# Altium project TP1 - Codificador Morse - Grupo 9.PrjPcb
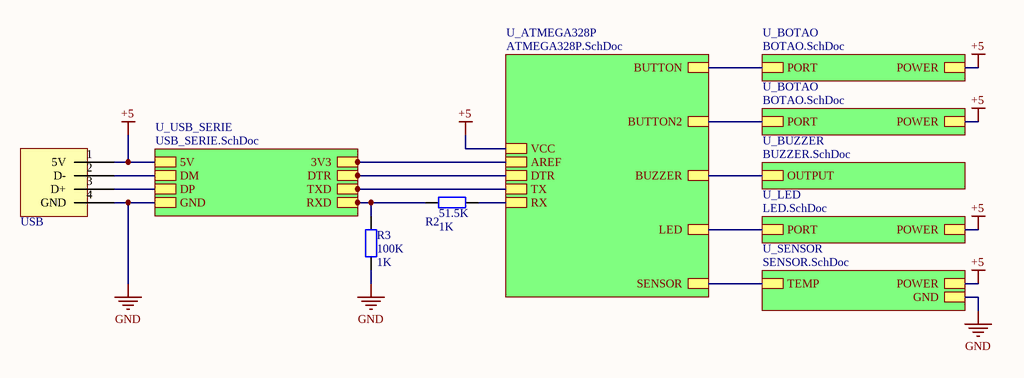
[diagram p0: MAIN.SchDoc]
7 sheets, 47 parts. Net scope: hierarchical (ports join the sheet entries above them; power ports are global).
Board file: MAIN.PcbDoc
Sheets:
  MAIN.SchDoc
    U_ATMEGA328P = ATMEGA328P.SchDoc
      U_BOTAO = BOTAO.SchDoc
    U_BOTAO = BOTAO.SchDoc
    U_BUZZER = BUZZER.SchDoc
    U_LED = LED.SchDoc
    U_SENSOR = SENSOR.SchDoc
    U_BOTAO = BOTAO.SchDoc
    U_USB_SERIE = USB_SERIE.SchDoc

## Sheet MAIN.SchDoc
size A4; SheetNumber: 1; SheetTotal: 7

### Parts
R2  51.5K  value 1K  [AXIAL-0.4]
R3  100K  value 1K  [AXIAL-0.4]
  USB  [USB_Port_PCB]

### Sub-sheets
U_ATMEGA328P = ATMEGA328P.SchDoc: DTR, SENSOR, BUTTON, BUTTON2, AREF, LED, BUZZER, RX, TX, VCC
U_BOTAO = BOTAO.SchDoc: POWER, PORT
U_BOTAO = BOTAO.SchDoc: POWER, PORT
U_BUZZER = BUZZER.SchDoc: OUTPUT
U_LED = LED.SchDoc: PORT, POWER
U_SENSOR = SENSOR.SchDoc: POWER, TEMP, GND
U_USB_SERIE = USB_SERIE.SchDoc: GND, DP, DM, 5V, TXD, DTR, RXD, 3V3

### Nets
+5: .1(5V) ; sheet U_ATMEGA328P/VCC, sheet U_BOTAO/POWER, sheet U_LED/POWER, sheet U_SENSOR/POWER, sheet U_BOTAO/POWER, sheet U_USB_SERIE/5V  [project net VCC]
GND: R3.1 .4(GND) ; sheet U_SENSOR/GND, sheet U_USB_SERIE/GND  [project net VBUS_DET]
VCCIO: sheet U_ATMEGA328P/AREF, sheet U_USB_SERIE/3V3
NetC4_1: sheet U_ATMEGA328P/DTR, sheet U_USB_SERIE/DTR
NetC5_U_BOTAO2_2: sheet U_ATMEGA328P/BUTTON2, sheet U_BOTAO/PORT
NetC5_U_BOTAO3_2: sheet U_ATMEGA328P/BUTTON, sheet U_BOTAO/PORT
NetC7_1: sheet U_ATMEGA328P/SENSOR, sheet U_SENSOR/TEMP
NetC10_2: .2(D-) ; sheet U_USB_SERIE/DM
NetC11_2: .3(D+) ; sheet U_USB_SERIE/DP
NetD1_C: sheet U_ATMEGA328P/LED, sheet U_LED/PORT
NetR2_1: R2.1 R3.2 ; sheet U_USB_SERIE/RXD
NetR2_2: R2.2 ; sheet U_ATMEGA328P/RX
NetR5_2: sheet U_ATMEGA328P/BUZZER, sheet U_BUZZER/OUTPUT
NetU1_3: sheet U_ATMEGA328P/TX, sheet U_USB_SERIE/TXD

### Library data of the parts
R2 R3 = Res2: Resistor; Published: 8-Jun-2000; LatestRevisionDate: 17-Jul-2002; LatestRevisionNote: Re-released for DXP Platform.; PackageReference: AXIAL-0.4; Publisher: Altium Limited; PackageDescription: Axial Device, Thru-Hole; 2 Leads; 0.4 in Pin Spacing

## Sheet ATMEGA328P.SchDoc
size A4; SheetNumber: 2; SheetTotal: 7; SPICEModelCacheTSLKCINH: <root> / <DocumentId>TSLKCINH</DocumentId> / <CacheFrame Number="0"> / <Model Name="cap" Kind="MDL"> / <Text>*Default semiconductor capacitor / .MODEL CAP C()</Text> / </Model> / </CacheFrame> / </root>
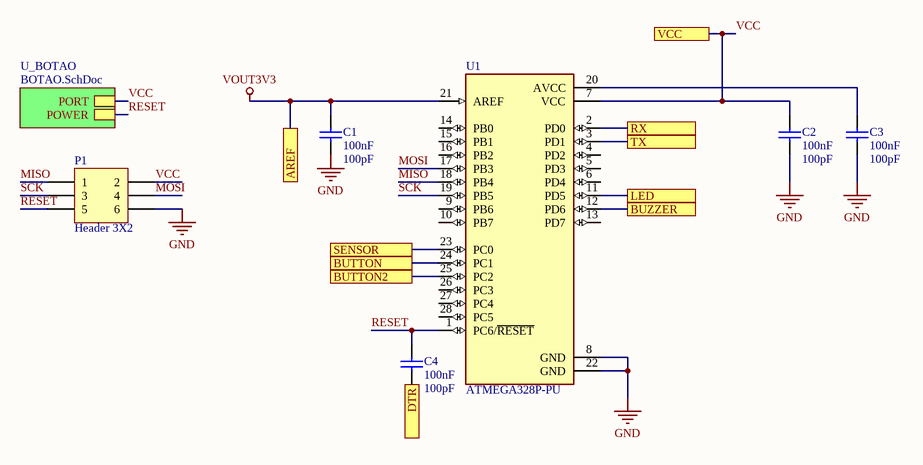
[diagram p1: ATMEGA328P.SchDoc]

### Parts
C1  100nF  value 100pF  [RAD-0.3]
C2  100nF  value 100pF  [RAD-0.3]
C3  100nF  value 100pF  [RAD-0.3]
C4  100nF  value 100pF  [RAD-0.3]
P1  Header 3X2  [HDR2X3]
U1  ATMEGA328P-PU  [DIP794W46P254L2967H457Q28B]

### Sub-sheets
U_BOTAO = BOTAO.SchDoc: POWER, PORT

### Ports
AREF, BUTTON, BUTTON2, BUZZER, DTR, LED, RX, SENSOR, TX, VCC

### Nets
GND: C1.1 C2.1 C3.1 P1.6 U1.8(GND) U1.22(GND)  [project net VBUS_DET]
VCC: C2.2 P1.2 U1.7(VCC) ; port VCC, sheet U_BOTAO/PORT
VOUT3V3: C1.2 U1.21(AREF) ; port AREF  [project net VCCIO]
MISO: P1.1 U1.18(PB4)
MOSI: P1.4 U1.17(PB3)
RESET: C4.2 P1.5 U1.1(PC6/~{RESET}) ; sheet U_BOTAO/POWER
SCK: P1.3 U1.19(PB5)
NetC3_2: C3.2 U1.20(AVCC)
NetC4_1: C4.1 ; port DTR
NetC5_U_BOTAO2_2: U1.25(PC2) ; port BUTTON2
NetC5_U_BOTAO3_2: U1.24(PC1) ; port BUTTON
NetC7_1: U1.23(PC0) ; port SENSOR
NetD1_C: U1.11(PD5) ; port LED
NetR2_2: U1.2(PD0) ; port RX
NetR5_2: U1.12(PD6) ; port BUZZER
NetU1_3: U1.3(PD1) ; port TX

Not connected (* = marked no-connect by the designer): U1 4(PD2) 5(PD3) 6(PD4) 9(PB6) 10(PB7) 13(PD7) 14(PB0) 15(PB1) 16(PB2) 26(PC3) 27(PC4) 28(PC5)

### Library data of the parts
C1-C4 = Cap: Capacitor; Published: 8-Jun-2000; LatestRevisionDate: 17-Jul-2002; LatestRevisionNote: Re-released for DXP Platform.; PackageReference: RAD-0.3; Publisher: Altium Limited; PackageDescription: Radial Cap, Thru-Hole; 2 Leads; 0.3 in Pin Spacing
P1 = Header 3X2: Header, 3-Pin, Dual row; LatestRevisionDate: 17-Jul-2002; LatestRevisionNote: Re-released for DXP Platform.; Publisher: Altium Limited
U1 = ATMEGA328P-PU: ATmega Series 20 MHz 32 KB Flash 2 KB SRAM 8-Bit Microcontroller - DIP-28; MP: ATMEGA328P-PU; Package: None; Availability: Unavailable; Price: None; Value: *

## Sheet BOTAO.SchDoc
size A4; SheetNumber: 4; SheetTotal: 7; SPICEModelCacheDMJNRZEX: <root> / <DocumentId>DMJNRZEX</DocumentId> / <CacheFrame Number="0"> / <Model Name="cap" Kind="MDL"> / <Text>*Default semiconductor capacitor / .MODEL CAP C()</Text> / </Model> / </CacheFrame> / </root>
Used 3 times, as channels U_ATMEGA328P/U_BOTAO, U_BOTAO, U_BOTAO. Parts and nets are listed once, with the designators drawn on the sheet.
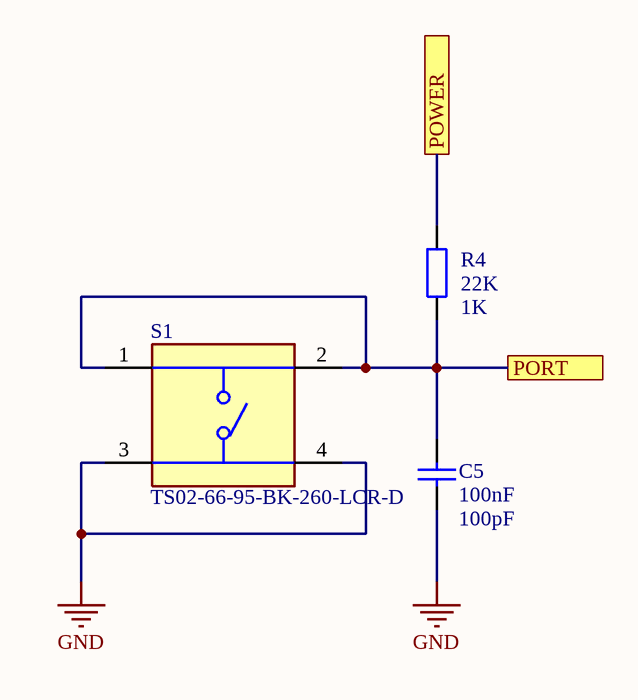
[diagram p2: BOTAO.SchDoc]

### Parts
C5  100nF  value 100pF  [RAD-0.3]
R4  22K  value 1K  [AXIAL-0.4]
S1  TS02-66-95-BK-260-LCR-D  [SW_TS02-66-95-BK-260-LCR-D]

### Ports
PORT, POWER

### Nets
GND: C5.1 S1.3 S1.4
PORT: C5.2 R4.1 S1.1 S1.2 ; port PORT
POWER: R4.2 ; port POWER

### Channels
U_ATMEGA328P/U_BOTAO: designators end in _U_BOTAO1; ports PORT=VCC POWER=RESET
U_BOTAO: designators end in _U_BOTAO3; ports PORT=NetC5_U_BOTAO3_2 POWER=VCC
U_BOTAO: designators end in _U_BOTAO2; ports PORT=NetC5_U_BOTAO2_2 POWER=VCC

### Library data of the parts
C5 = Cap: Capacitor; Published: 8-Jun-2000; LatestRevisionDate: 17-Jul-2002; LatestRevisionNote: Re-released for DXP Platform.; PackageReference: RAD-0.3; Publisher: Altium Limited; PackageDescription: Radial Cap, Thru-Hole; 2 Leads; 0.3 in Pin Spacing
R4 = Res2: Resistor; Published: 8-Jun-2000; LatestRevisionDate: 17-Jul-2002; LatestRevisionNote: Re-released for DXP Platform.; PackageReference: AXIAL-0.4; Publisher: Altium Limited; PackageDescription: Axial Device, Thru-Hole; 2 Leads; 0.4 in Pin Spacing
S1 = TS02-66-95-BK-260-LCR-D: Price: None; Availability: Unavailable; MP: TS02-66-95-BK-260-LCR-D; Value: *; Package: None

## Sheet BUZZER.SchDoc
size A4; SheetNumber: 5; SheetTotal: 7
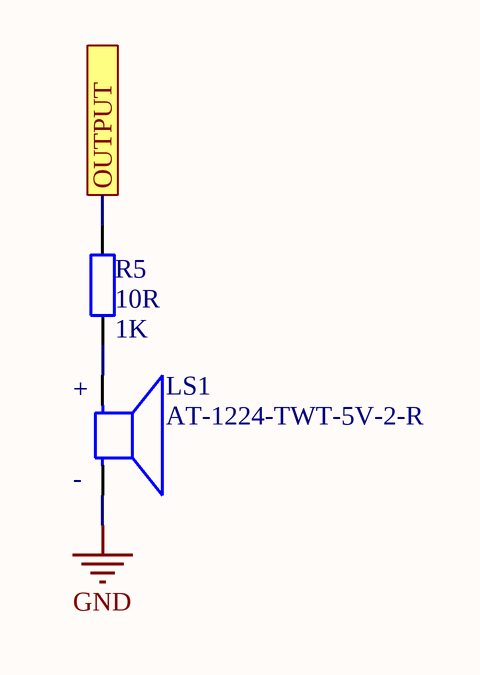
[diagram p3: BUZZER.SchDoc]

### Parts
LS1  AT-1224-TWT-5V-2-R  [XDCR_AT-1224-TWT-5V-2-R]
R5  10R  value 1K  [AXIAL-0.4]

### Ports
OUTPUT

### Nets
GND: LS1.N  [project net VBUS_DET]
NetLS1_P: LS1.P R5.1
NetR5_2: R5.2 ; port OUTPUT

### Notes on the sheet
- (in symbol AT-1224-TWT-5V-2-R) +; -

### Library data of the parts
LS1 = AT-1224-TWT-5V-2-R: AUDIO TRANSDUCER 12 VP-P 85 DB 2400 HZ; Package: None; Price: None; Value: *; MP: AT-1224-TWT-5V-2-R; Availability: Unavailable
R5 = Res2: Resistor; Published: 8-Jun-2000; LatestRevisionDate: 17-Jul-2002; LatestRevisionNote: Re-released for DXP Platform.; PackageReference: AXIAL-0.4; Publisher: Altium Limited; PackageDescription: Axial Device, Thru-Hole; 2 Leads; 0.4 in Pin Spacing

## Sheet LED.SchDoc
size A4; SheetNumber: 3; SheetTotal: 7
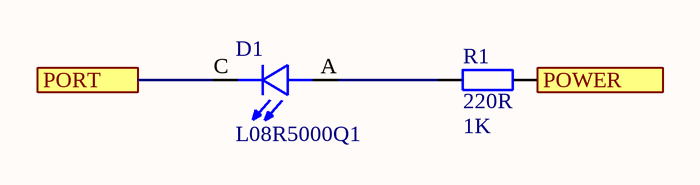
[diagram p4: LED.SchDoc]

### Parts
D1  L08R5000Q1  [LEDRD254W57D500H1070]
R1  220R  value 1K  [AXIAL-0.4]

### Ports
PORT, POWER

### Nets
VCC: R1.2 ; port POWER
NetD1_A: D1.A R1.1
NetD1_C: D1.C ; port PORT

### Library data of the parts
D1 = L08R5000Q1: LED, 5MM, ORANGE; LED / Lamp Size: 5mm / T-1 3/4; LED Colour: Orange; Typ Luminous Intensity: 4.3mcd; Viewing Angle: ...; MF: LED Technology; Value: *; SnapEDA_Link: https://www.snapeda.com/parts/L08R5000Q1/LED+Technology/view-part/?ref=snap; MP: L08R5000Q1; Check_prices: https://www.snapeda.com/parts/L08R5000Q1/LED+Technology/view-part/?ref=eda; Availability: In Stock; Price: None; Package: None
R1 = Res2: Resistor; Published: 8-Jun-2000; LatestRevisionDate: 17-Jul-2002; LatestRevisionNote: Re-released for DXP Platform.; PackageReference: AXIAL-0.4; Publisher: Altium Limited; PackageDescription: Axial Device, Thru-Hole; 2 Leads; 0.4 in Pin Spacing

## Sheet SENSOR.SchDoc
size A4; SheetNumber: 6; SheetTotal: 7; SPICEModelCacheEPDGRBMA: <root> / <DocumentId>EPDGRBMA</DocumentId> / <CacheFrame Number="0"> / <Model Name="cap" Kind="MDL"> / <Text>*Default semiconductor capacitor / .MODEL CAP C()</Text> / </Model> / </CacheFrame> / </root>
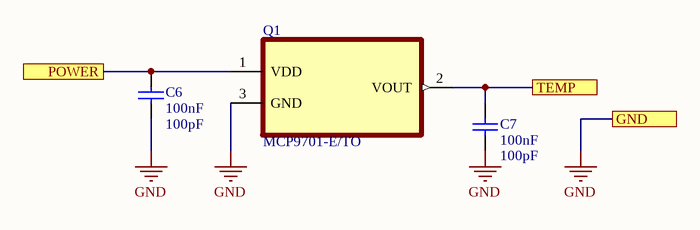
[diagram p5: SENSOR.SchDoc]

### Parts
C6  100nF  value 100pF  [RAD-0.3]
C7  100nF  value 100pF  [RAD-0.3]
Q1  MCP9701-E/TO  [TO127P254X533-3]

### Ports
GND, POWER, TEMP

### Nets
GND: C6.2 C7.2 Q1.3(GND) ; port GND  [project net VBUS_DET]
VCC: C6.1 Q1.1(VDD) ; port POWER
NetC7_1: C7.1 Q1.2(VOUT) ; port TEMP

### Library data of the parts
C6 C7 = Cap: Capacitor; Published: 8-Jun-2000; LatestRevisionDate: 17-Jul-2002; LatestRevisionNote: Re-released for DXP Platform.; PackageReference: RAD-0.3; Publisher: Altium Limited; PackageDescription: Radial Cap, Thru-Hole; 2 Leads; 0.3 in Pin Spacing
Q1 = MCP9701-E/TO: 3 TO-92 4x4mm BAG, Linear Active Thermister (TM) IC (19.53mV/oC) | Microchip Technology Inc. MCP9701-E/TO; SnapEDA_Link: https://www.snapeda.com/parts/MCP9701-E/TO/Microchip/view-part/?ref=snap; Package: TO-92 Microchip; Value: *; MF: Microchip Technology; MP: MCP9701-E/TO; Check_prices: https://www.snapeda.com/parts/MCP9701-E/TO/Microchip/view-part/?ref=eda

## Sheet USB_SERIE.SchDoc
size A4; SheetNumber: 7; SheetTotal: 7; SPICEModelCacheZQRZJMEL: <root> / <DocumentId>ZQRZJMEL</DocumentId> / </root>
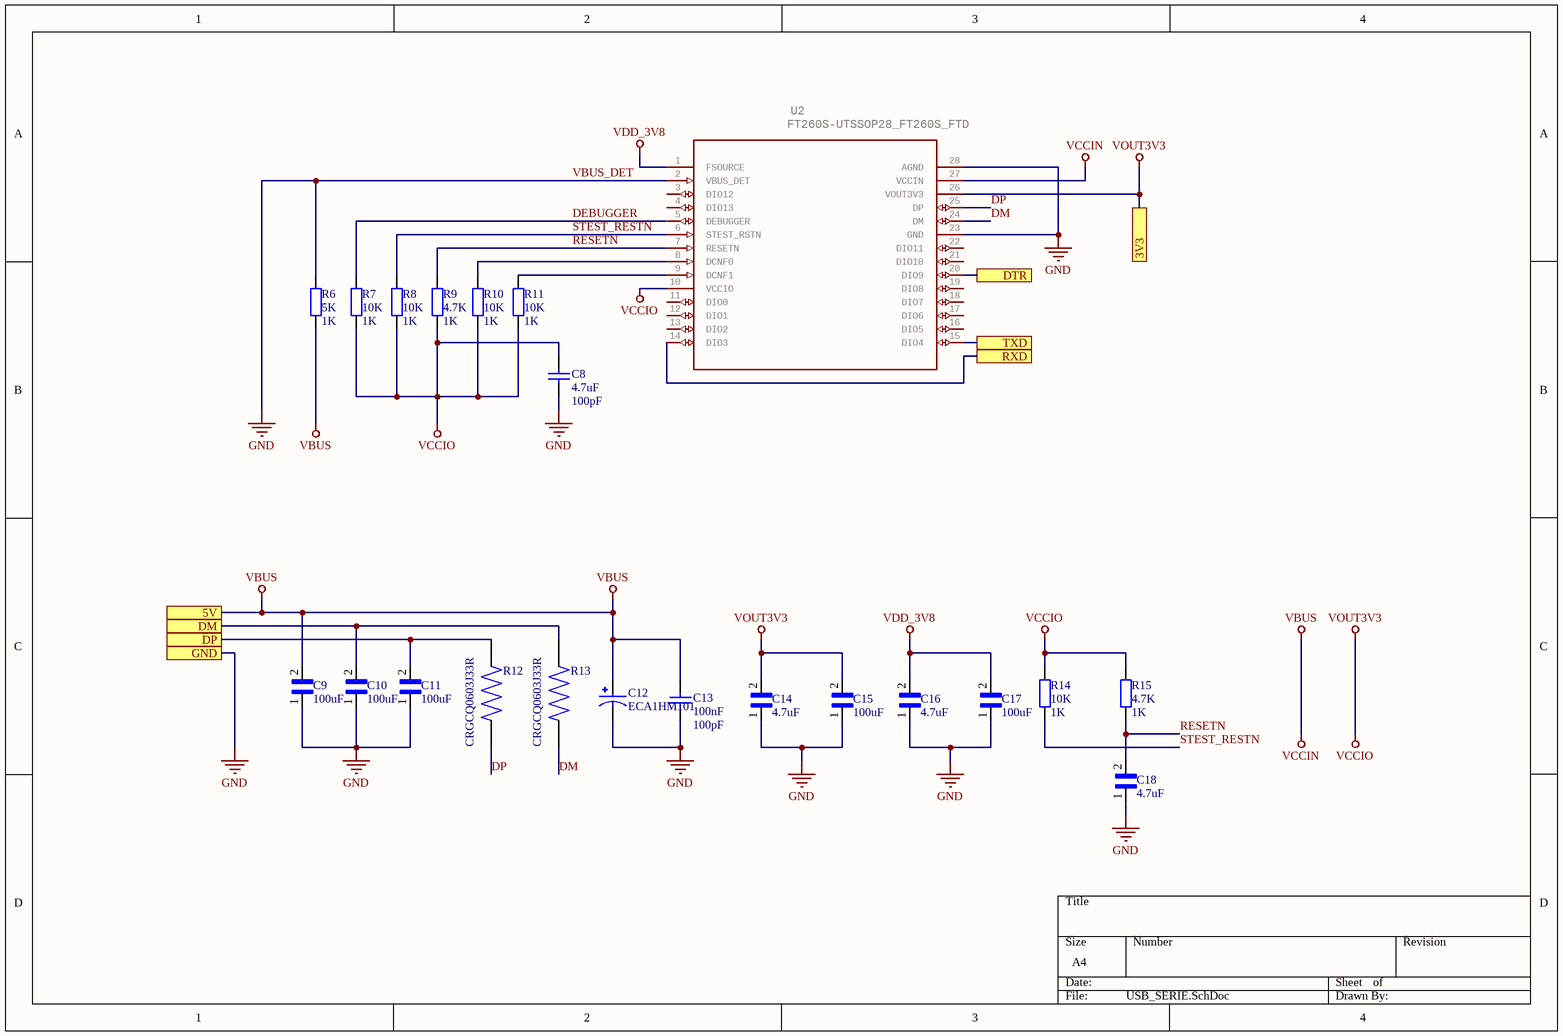
[diagram p6: USB_SERIE.SchDoc]

### Parts
C8  4.7uF  value 100pF  [RAD-0.3]
C9  100uF  [CAPC1608X90N]
C10  100uF  [CAPC1608X90N]
C11  100uF  [CAPC1608X90N]
C12  ECA1HM101  [CAPPRD350W60D800H1150]
C13  100nF  value 100pF  [RAD-0.3]
C14  4.7uF  [CAPC1608X94N]
C15  100uF  [CAPC1608X90N]
C16  4.7uF  [CAPC1608X94N]
C17  100uF  [CAPC1608X90N]
C18  4.7uF  [CAPC1608X94N]
R6  5K  value 1K  [AXIAL-0.4]
R7  10K  value 1K  [AXIAL-0.4]
R8  10K  value 1K  [AXIAL-0.4]
R9  4.7K  value 1K  [AXIAL-0.4]
R10  10K  value 1K  [AXIAL-0.4]
R11  10K  value 1K  [AXIAL-0.4]
R12  CRGCQ0603J33R  [RESC1608X55N]
R13  CRGCQ0603J33R  [RESC1608X55N]
R14  10K  value 1K  [AXIAL-0.4]
R15  4.7K  value 1K  [AXIAL-0.4]
U2  FT260S-UTSSOP28_FT260S_FTD  [SOP65P640X110-28N]

### Ports
3V3, 5V, DM, DP, DTR, GND, RXD, TXD

### Nets
VBUS: C9.2 C12.P C13.2 R6.1 U2.27(VCCIN) ; port 5V  [also labelled VCCIN]  [project net VCC]
VBUS_DET: C8.1 C9.1 C10.1 C11.1 C12.N C13.1 C14.1 C15.1 C16.1 C17.1 C18.1 R6.2 U2.2(VBUS_DET) U2.23(GND) U2.28(AGND) ; port GND  [also labelled GND]
VCCIO: C8.2 C14.2 C15.2 R7.1 R8.1 R9.1 R10.1 R11.1 R14.2 R15.2 U2.10(VCCIO) U2.26(VOUT3V3) ; port 3V3  [also labelled VOUT3V3]
VDD_3V8: C16.2 C17.2 U2.1(FSOURCE)
DEBUGGER: R7.2 U2.5(DEBUGGER)
DM: R13.1 U2.24(DM)
DP: R12.1 U2.25(DP)
RESETN: C18.2 R9.2 R15.1 U2.7(RESETN)
STEST_RESTN: R8.2 R14.1 U2.6(STEST_RSTN)
NetC4_1: U2.20(DIO9) ; port DTR
NetC10_2: C10.2 R13.2 ; port DM
NetC11_2: C11.2 R12.2 ; port DP
NetR2_1: U2.14(DIO3) ; port RXD
NetR10_2: R10.2 U2.8(DCNF0)
NetR11_2: R11.2 U2.9(DCNF1)
NetU1_3: U2.15(DIO4) ; port TXD

Not connected (* = marked no-connect by the designer): U2 3(DIO12) 4(DIO13) 11(DIO0) 12(DIO1) 13(DIO2) 16(DIO5) 17(DIO6) 18(DIO7) 19(DIO8) 21(DIO10) 22(DIO11)

### Library data of the parts
C8 C13 = Cap: Capacitor; Published: 8-Jun-2000; LatestRevisionDate: 17-Jul-2002; LatestRevisionNote: Re-released for DXP Platform.; PackageReference: RAD-0.3; Publisher: Altium Limited; PackageDescription: Radial Cap, Thru-Hole; 2 Leads; 0.3 in Pin Spacing
C9-C11 C15 C17 = 06033C103KAT2A: Cap Ceramic 0.01uF 25V X7R 10% Pad SMD 0603 125C T/R; Package: None; Price: None; Value: *; MP: 06033C103KAT2A; Availability: Unavailable
C12 = ECA1HM101: 100ÂµF 50V Aluminum Electrolytic Capacitors Radial, Can 2000 Hrs @ 85Â°C; MF: Panasonic; Check_prices: https://www.snapeda.com/parts/ECA1HM101/Panasonic/view-part/4478734/?ref=eda; SnapEDA_Link: https://www.snapeda.com/parts/ECA1HM101/Panasonic/view-part/4478734/?ref=snap; Price: None; Availability: No availability data; Package: RADIAL-2 Panasonic; MP: ECA1HM101; Value: *
C14 C16 C18 = 06036D475KAT4A: Cap Ceramic 4.7uF 6.3V X5R 10% SMD 0603 85Â°C Paper T/R; Package: None; Price: None; Value: *; MP: 06036D475KAT4A; Availability: Unavailable
R6-R11 R14 R15 = Res2: Resistor; Published: 8-Jun-2000; LatestRevisionDate: 17-Jul-2002; LatestRevisionNote: Re-released for DXP Platform.; PackageReference: AXIAL-0.4; Publisher: Altium Limited; PackageDescription: Axial Device, Thru-Hole; 2 Leads; 0.4 in Pin Spacing
R12 R13 = CRGCQ0603J33R: Fixed Resistor CRGCQ 0603 33R 5%; Package: None; Price: None; Value: *; MP: CRGCQ0603J33R; Availability: Unavailable
U2 = FT260S-UTSSOP28_FT260S_FTD: Mfr_Name: FTDI, Future Technology Devices International Ltd; GateName_1: A; SymbolName_1: FT260S-U; DeviceName: TSSOP28_FT260S_FTD; LibraryName: 2024-10-31_11-49-55_Library; DeviceSetName: FT260S-U; Package: TSSOP28_FT260S_FTD; Copyright: Copyright (C) 2024 Ultra Librarian. All rights reserved.; Manufacturer_Part_Number: FT260S-U

## Nets that join several sheets
VBUS_DET: MAIN (R3.1 .4), ATMEGA328P (6 pins), U_ATMEGA328P/U_BOTAO (C5_U_BOTAO1.1 S1_U_BOTAO1.3 S1_U_BOTAO1.4), U_BOTAO (C5_U_BOTAO3.1 S1_U_BOTAO3.3 S1_U_BOTAO3.4), BUZZER (LS1.N), SENSOR (C6.2 C7.2 Q1.3), U_BOTAO (C5_U_BOTAO2.1 S1_U_BOTAO2.3 S1_U_BOTAO2.4), USB_SERIE (15 pins)
VCC: MAIN (.1), ATMEGA328P (C2.2 P1.2 U1.7), U_ATMEGA328P/U_BOTAO (C5_U_BOTAO1.2 R4_U_BOTAO1.1 S1_U_BOTAO1.1 S1_U_BOTAO1.2), U_BOTAO (R4_U_BOTAO3.2), LED (R1.2), SENSOR (C6.1 Q1.1), U_BOTAO (R4_U_BOTAO2.2), USB_SERIE (5 pins)
VCCIO: ATMEGA328P (C1.2 U1.21), USB_SERIE (12 pins)
NetC4_1: ATMEGA328P (C4.1), USB_SERIE (U2.20)
NetC5_U_BOTAO2_2: ATMEGA328P (U1.25), U_BOTAO (C5_U_BOTAO2.2 R4_U_BOTAO2.1 S1_U_BOTAO2.1 S1_U_BOTAO2.2)
NetC5_U_BOTAO3_2: ATMEGA328P (U1.24), U_BOTAO (C5_U_BOTAO3.2 R4_U_BOTAO3.1 S1_U_BOTAO3.1 S1_U_BOTAO3.2)
NetC7_1: ATMEGA328P (U1.23), SENSOR (C7.1 Q1.2)
NetC10_2: MAIN (.2), USB_SERIE (C10.2 R13.2)
NetC11_2: MAIN (.3), USB_SERIE (C11.2 R12.2)
NetD1_C: ATMEGA328P (U1.11), LED (D1.C)
NetR2_1: MAIN (R2.1 R3.2), USB_SERIE (U2.14)
NetR2_2: MAIN (R2.2), ATMEGA328P (U1.2)
NetR5_2: ATMEGA328P (U1.12), BUZZER (R5.2)
NetU1_3: ATMEGA328P (U1.3), USB_SERIE (U2.15)
RESET: ATMEGA328P (C4.2 P1.5 U1.1), U_ATMEGA328P/U_BOTAO (R4_U_BOTAO1.2)